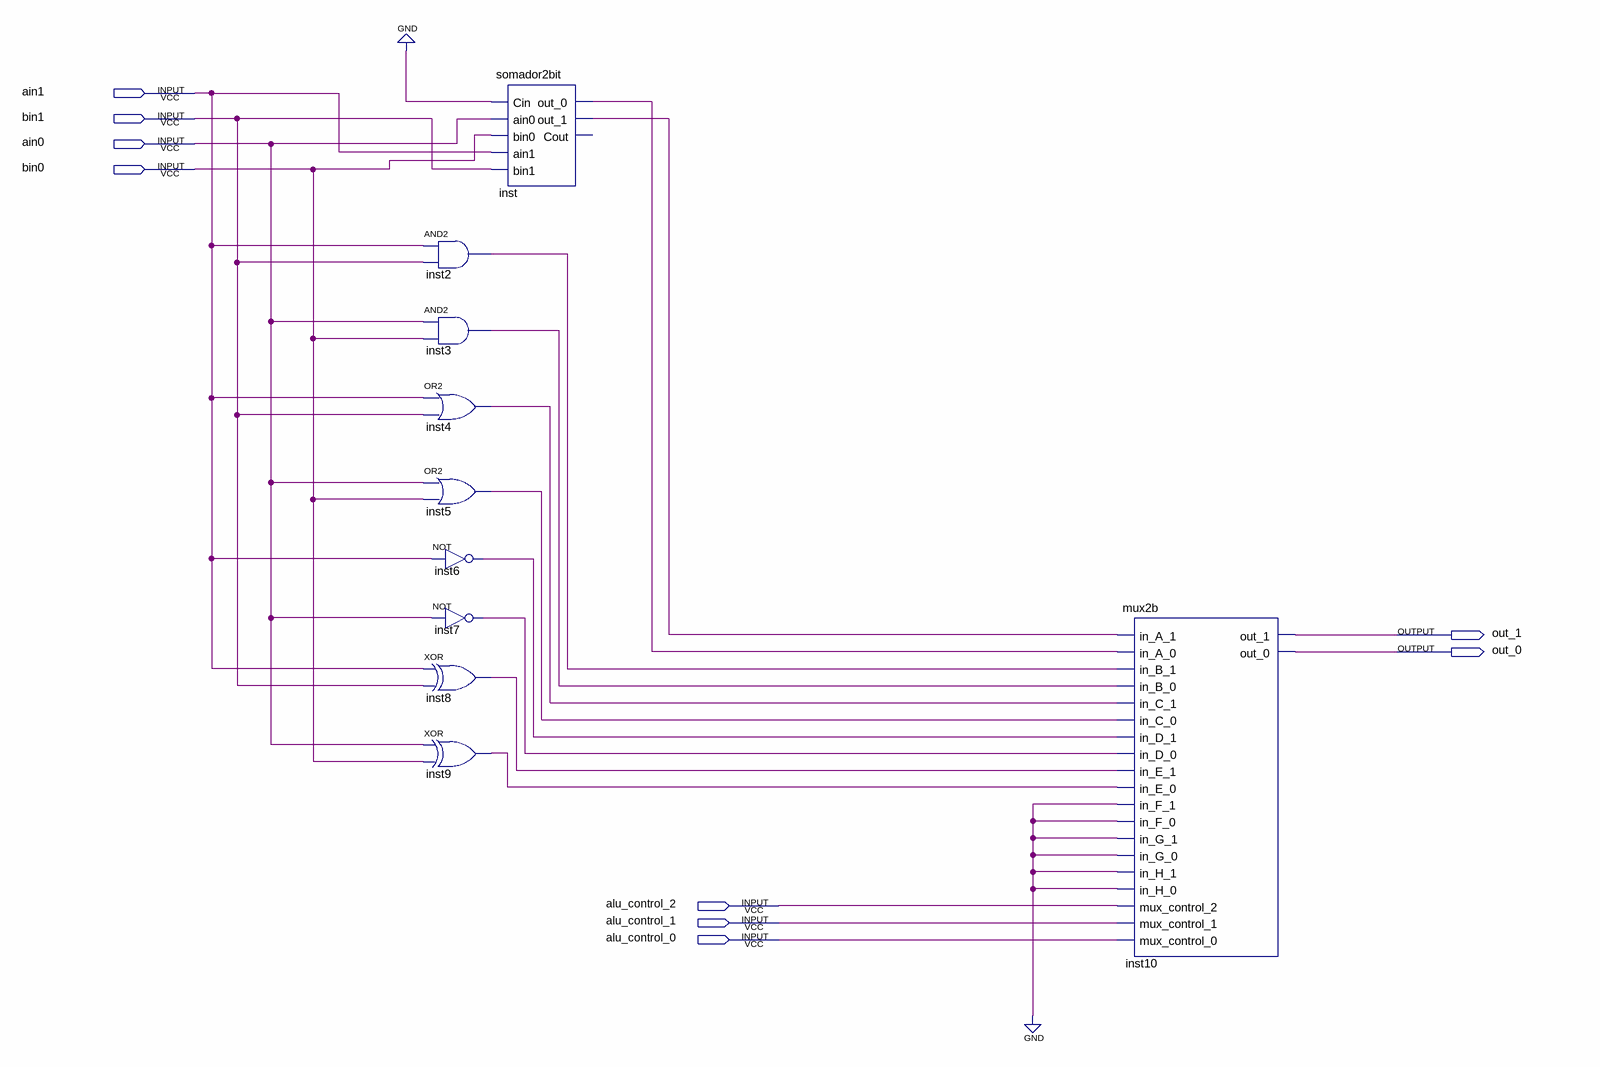
[diagram p0: schematic sheet]
// Quartus schematic ula2b.bdf as structural Verilog: 10 symbols, 9 pins
module ula2b (
  input  ain1,
  input  bin1,
  input  ain0,
  input  bin0,
  input  alu_control_2,
  input  alu_control_1,
  input  alu_control_0,
  output out_1,
  output out_0
);

  wire inst2_out, inst3_out, inst4_out, inst5_out, inst6_out, inst7_out, inst8_out, inst9_out, inst_out_0,
       inst_out_1;

  and inst2 (inst2_out, ain1, bin1);
  and inst3 (inst3_out, ain0, bin0);
  or inst4 (inst4_out, ain1, bin1);
  or inst5 (inst5_out, ain0, bin0);
  not inst6 (inst6_out, ain1);
  not inst7 (inst7_out, ain0);
  xor inst8 (inst8_out, ain1, bin1);
  xor inst9 (inst9_out, ain0, bin0);
  somador2bit inst (
    .Cin(1'b0), .ain0(ain0), .bin0(bin0), .ain1(ain1), .bin1(bin1), .out_0(inst_out_0), .out_1(inst_out_1));  // open: Cout
  mux2b inst10 (
    .in_A_1(inst_out_1), .in_A_0(inst_out_0), .in_B_1(inst2_out), .in_B_0(inst3_out), .in_C_1(inst4_out),
    .in_C_0(inst5_out), .in_D_1(inst6_out), .in_D_0(inst7_out), .in_E_1(inst8_out), .in_E_0(inst9_out),
    .in_F_1(1'b0), .in_F_0(1'b0), .in_G_1(1'b0), .in_G_0(1'b0), .in_H_1(1'b0), .in_H_0(1'b0),
    .mux_control_2(alu_control_2), .mux_control_1(alu_control_1), .mux_control_0(alu_control_0),
    .out_1(out_1), .out_0(out_0));
endmodule
